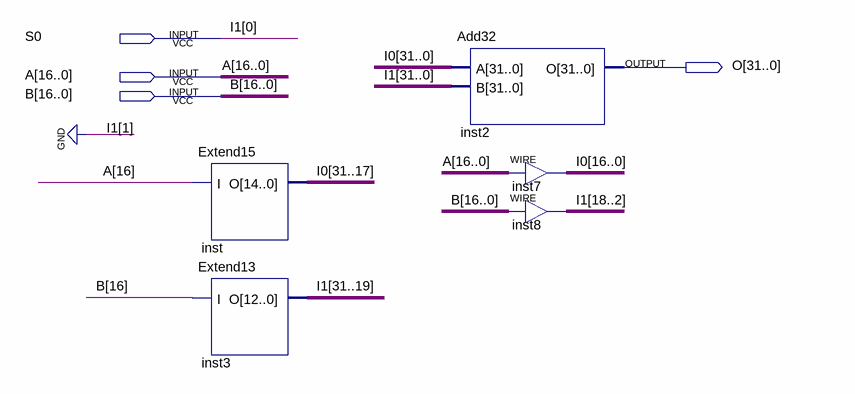
[diagram p0: schematic sheet]
// Quartus schematic R0R1.bdf as structural Verilog: 5 symbols, 4 pins
module R0R1 (
  input  S0,
  input  [16:0] A,
  input  [16:0] B,
  output [31:0] O
);

  wire [31:0] I0;
  wire [31:2] I1;

  Extend15 inst (.I(A[16]), .O(I0[31:17]));
  Extend13 inst3 (.I(B[16]), .O(I1[31:19]));
  Add32 inst2 (.A(I0), .B({I1, 1'b0, S0}), .O(O));
  assign I0[16:0] = A;  // WIRE inst7
  assign I1[18:2] = B;  // WIRE inst8

  // Other names for the same wires on the sheet: I1[0] = S0
endmodule
